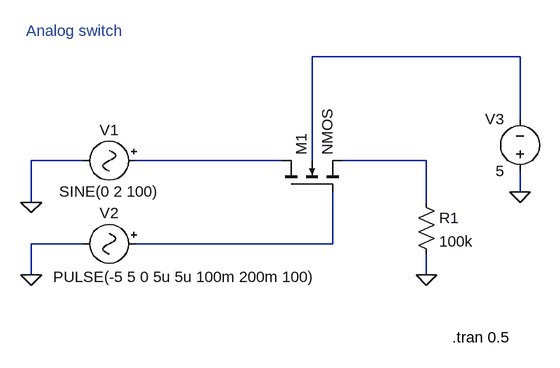
[diagram p0: schematic Draft8.asc]
Draft8.asc, the LTspice schematic file:
Version 4
SHEET 1 1108 680
WIRE 720 176 400 176
WIRE 720 272 720 176
WIRE 48 336 -32 336
WIRE 352 336 128 336
WIRE 400 336 400 176
WIRE 576 336 448 336
WIRE 720 384 720 352
WIRE -32 400 -32 336
WIRE 576 400 576 336
WIRE 48 464 -32 464
WIRE 432 464 432 384
WIRE 432 464 128 464
WIRE -32 512 -32 464
WIRE 576 512 576 480
FLAG -32 512 0
FLAG -32 400 0
FLAG 576 512 0
FLAG 720 384 0
SYMBOL Misc/signal 144 336 R90
WINDOW 0 -32 56 VBottom 2
WINDOW 3 32 56 VTop 2
SYMATTR InstName V1
SYMATTR Value SINE(0 2 100)
SYMBOL Misc/signal 144 464 R90
WINDOW 0 -32 56 VBottom 2
WINDOW 3 35 -61 VTop 2
SYMATTR InstName V2
SYMATTR Value PULSE(-5 5 0 5u 5u 100m 200m 100)
SYMBOL res 560 384 R0
SYMATTR InstName R1
SYMATTR Value 100k
SYMBOL nmos4 352 384 R270
SYMATTR InstName M1
SYMBOL voltage 720 368 R180
WINDOW 0 24 96 Left 2
WINDOW 3 24 16 Left 2
SYMATTR InstName V3
SYMATTR Value 5
TEXT 616 608 Left 2 !.tran 0.5
TEXT -40 136 Left 2 ;Analog switch

The netlist it stands for:
* Draft8.asc
V1 N002 0 SINE(0 2 100)
V2 N004 0 PULSE(-5 5 0 5u 5u 100m 200m 100)
R1 N003 0 100k
M1 N002 N004 N003 N001 NMOS
V3 0 N001 5
.model NMOS NMOS
.model PMOS PMOS
.lib standard.mos
.tran 0.5
* Analog switch
.backanno
.end